# EAGLE design kline to db9 (EAGLE 4.13)
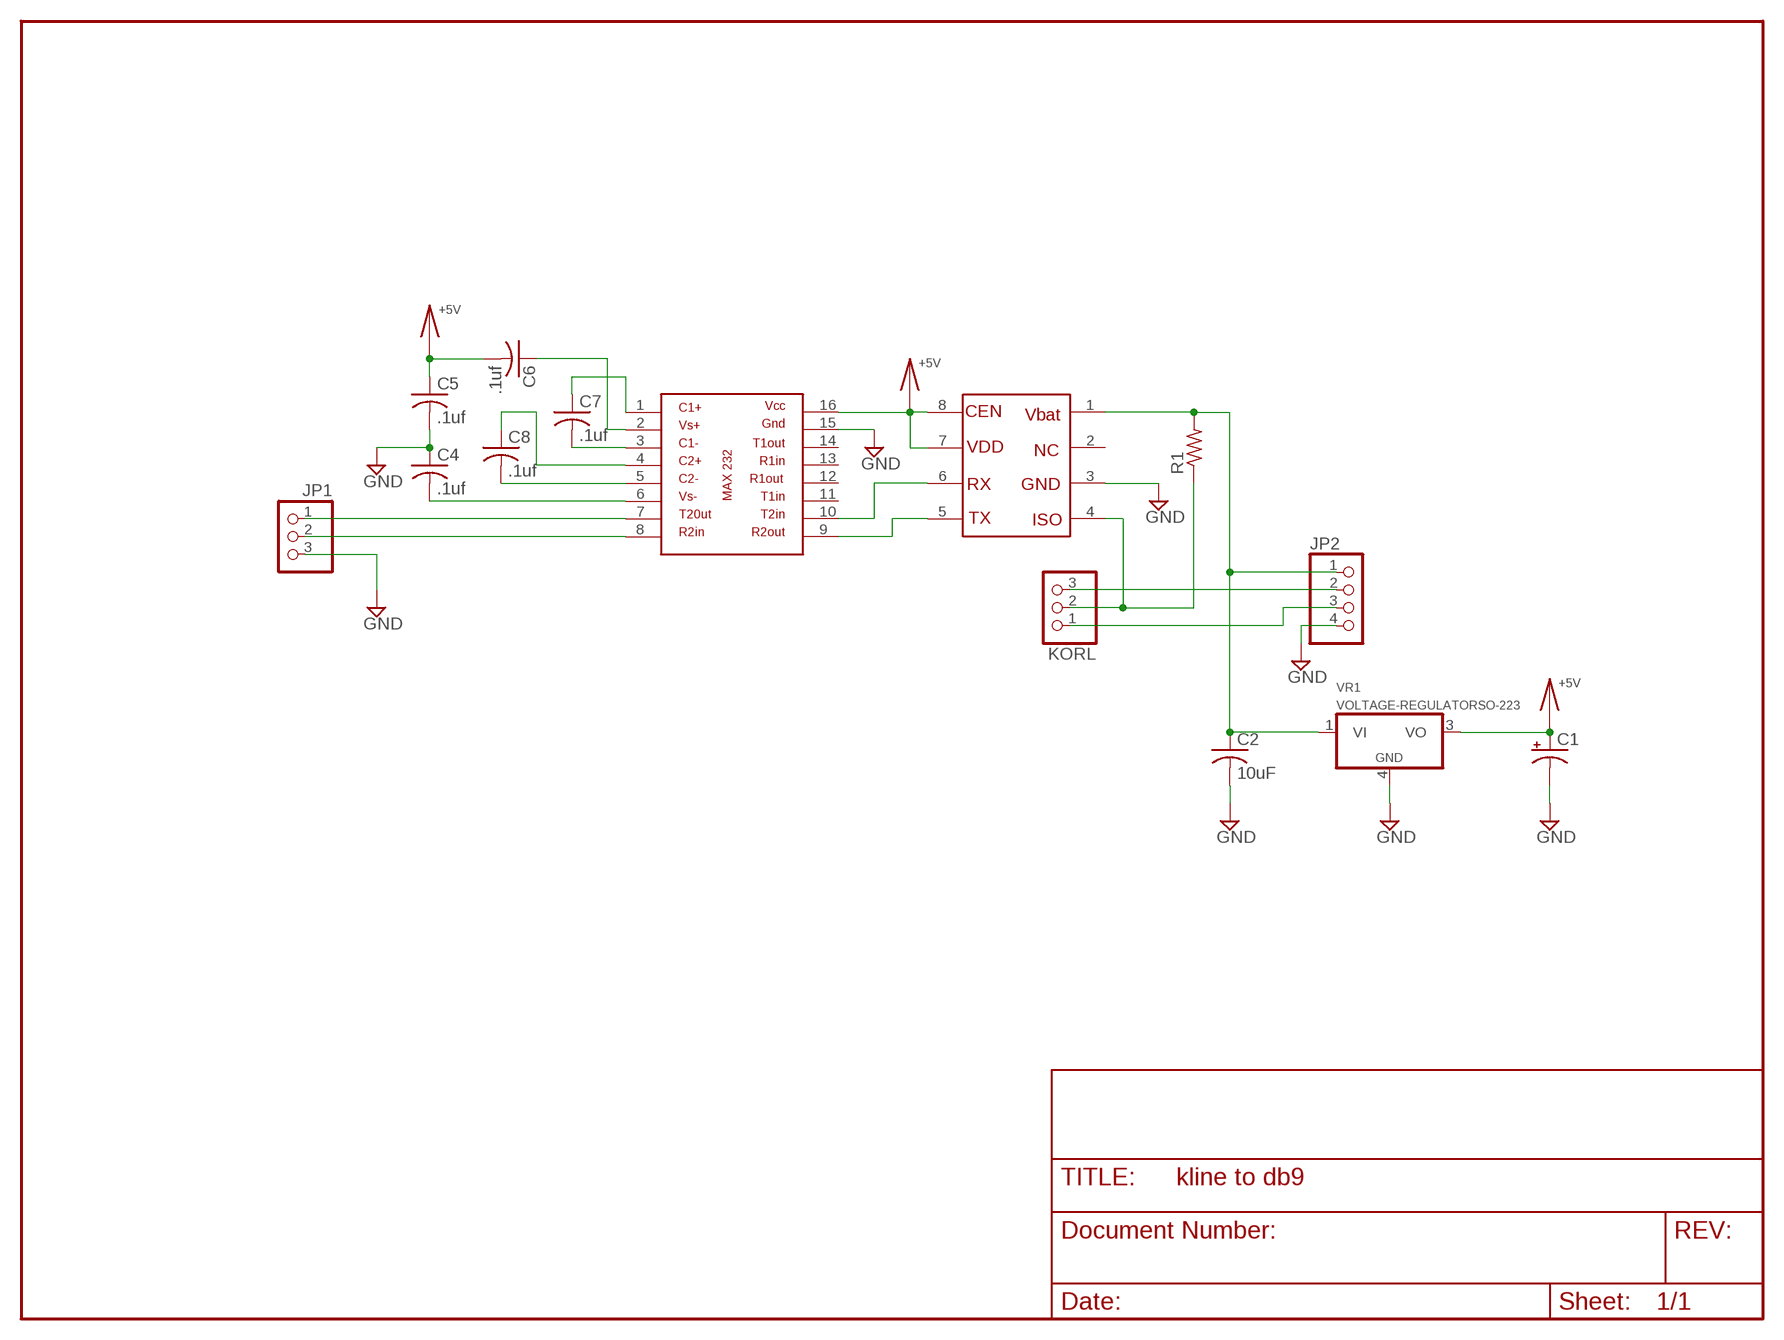
[diagram p0: schematic, sheet 1]

## Parts
C1  CAPACITOR-ELECTROLYTICD  [PANASONIC_D]
C2  10uF  CAPACITOR-NO-POLARITYC1210K  [C1210K]
C4  .1uf  CAPACITOR-NO-POLARITYC1210K  [C1210K]
C5  .1uf  CAPACITOR-NO-POLARITYC1210K  [C1210K]
C6  .1uf  CAPACITOR-NO-POLARITYC1210K  [C1210K]
C7  .1uf  CAPACITOR-NO-POLARITYC1210K  [C1210K]
C8  .1uf  CAPACITOR-NO-POLARITYC1210K  [C1210K]
JP1  PINHD-1X3  [1X03]
JP2  PINHD-1X4  [1X04]
KORL  PINHD-1X3  [1X03]
MCZ33290  MCZ33290  [SO08]
R1  RESISITOR0411/15  [0411/15]
U$1  MAX232  [SO16]
VR1  VOLTAGE-REGULATORSO-223  [SOT223R_INFINEON]

## Nets
+5V: C1.+ C5.1 C6.2 MCZ33290.7 MCZ33290.8 U$1.16 VR1.3(VO)
GND: C1.- C2.2 C4.1 C5.2 JP1.3 JP2.4 MCZ33290.3 U$1.15 VR1.4(GND)
N$1: JP2.2 KORL.3
N$2: C2.1 JP2.1 MCZ33290.1 R1.2 VR1.1(VI)
N$3: KORL.2 MCZ33290.4 R1.1
N$4: JP2.3 KORL.1
N$6: MCZ33290.6 U$1.10
N$7: MCZ33290.5 U$1.9
N$8: JP1.1 U$1.7
N$9: JP1.2 U$1.8
N$13: C6.1 U$1.2
N$14: C7.2 U$1.3
N$15: C7.1 U$1.1
N$16: C8.2 U$1.5
N$17: C4.2 U$1.6
N$18: C8.1 U$1.4
Unconnected: MCZ33290.2 U$1.11 U$1.12 U$1.13 U$1.14

## Library data of the parts
C1 = 1 Dan's Common Parts:CAPACITOR-ELECTROLYTIC: POLARIZED CAPACITOR, American symbol
C2 C4-C8 = 1 Dan's Common Parts:CAPACITOR-NO-POLARITY: CAPACITOR, American symbol
JP1 KORL = pinhead:PINHD-1X3: PIN HEADER
JP2 = pinhead:PINHD-1X4: PIN HEADER
MCZ33290 = 1 Dan's Common Parts:MCZ33290
R1 = 1 Dan's Common Parts:RESISITOR: RESISTOR, American symbol
U$1 = 1 Dan's Common Parts:MAX232
VR1 = 1 Dan's Common Parts:VOLTAGE-REGULATOR: Positive VOLTAGE REGULATOR Source: http://cache.national.com/ds/LM/LM78L05.pdf http://www.fairchildsemi.com/ds/LM/LM7805.pdf

## Board
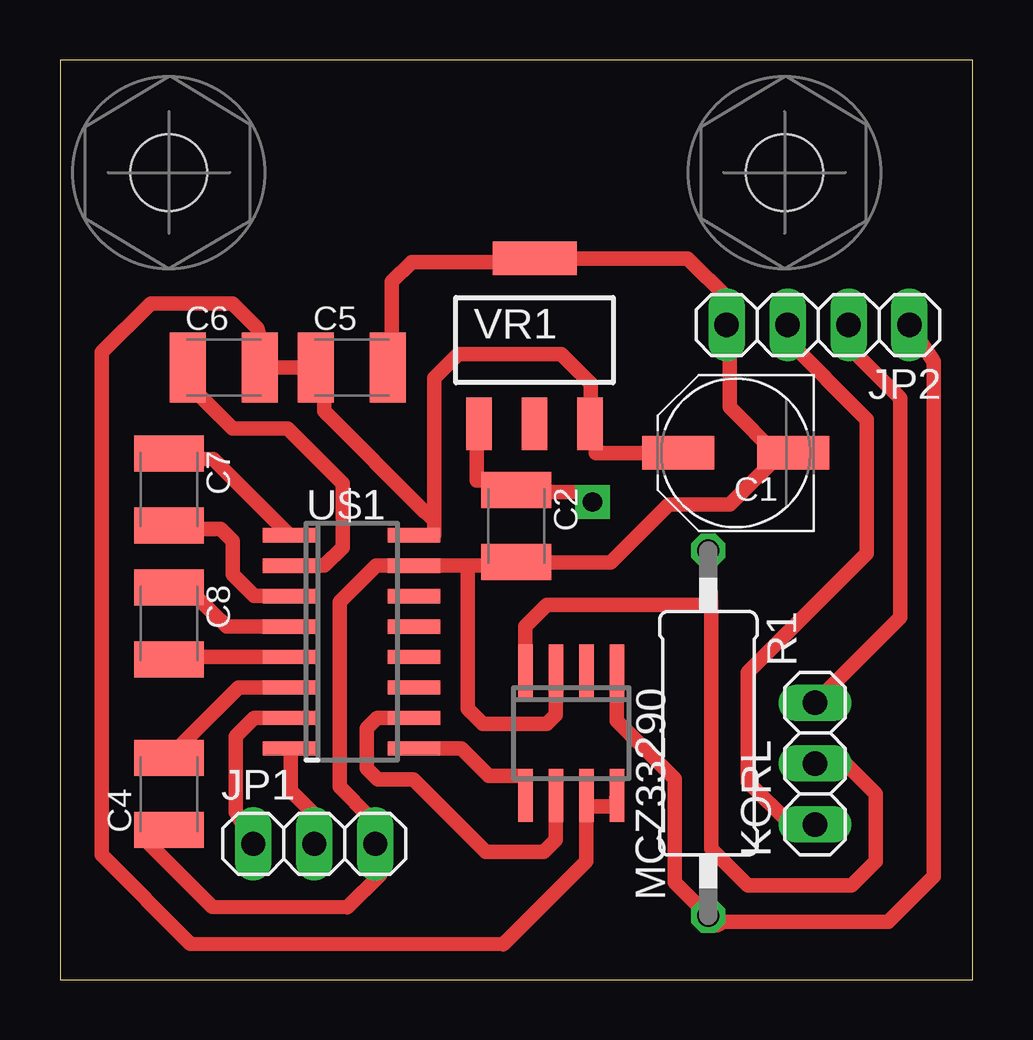
[diagram p1: board, top side]
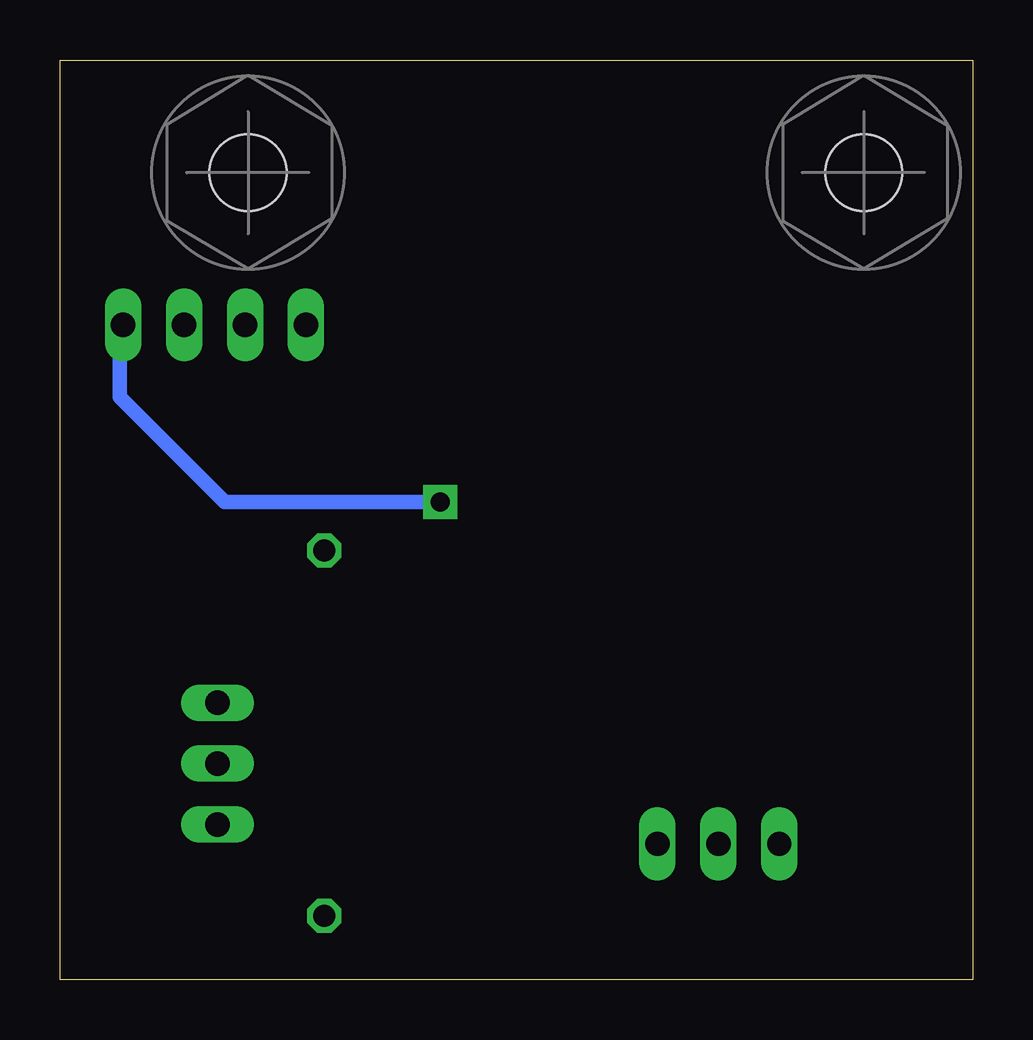
[diagram p2: board, bottom side, seen from below]

Size 38.02 x 38.34 mm. Coordinates in mm from the lower left corner, seen from the top.
Outline: 0,0 38.02,0 38.02,38.34 0,38.34 0,0
Copper layers (1*16): Top 0.035mm / dielectric 1.5mm / Bottom 0.035mm
Design rules "default": minimum track width 15mil, minimum drill 24mil, track to track 20mil, track to pad 20mil, pad to pad 20mil, via to via 20mil, smd to smd 20mil, copper to edge 40mil, drill to drill 8mil, minimum pad ring 10mil, minimum via ring 8mil, stop-mask expansion 4mil, vias tented up to drill 0mil, thermal gap 10mil

### Footprints (pad centres in the part's own frame; a part is rotated, then mirrored left to right if it is on the bottom)
PANASONIC_D = smd 3 x 1.4: + 2.4,0; - -2.4,0
C1210K = smd 1.5 x 2.9: 1 -1.5,0; 2 1.5,0
1X03 = drill 1.016 long: 1 -2.54,0; 2 0,0; 3 2.54,0
1X04 = drill 1.016 long: 1 -3.81,0; 2 -1.27,0; 3 1.27,0; 4 3.81,0
SO08 = smd 0.6 x 2.2: 1 -1.905,-2.6; 2 -0.635,-2.6; 3 0.635,-2.6; 4 1.905,-2.6; 5 1.905,2.6; 6 0.635,2.6; 7 -0.635,2.6; 8 -1.905,2.6
0411/15 = drill 0.914 octagon: 1 -7.62,0; 2 7.62,0
SO16 = smd 0.6 x 2.2: 1 -4.445,-2.6; 2 -3.175,-2.6; 3 -1.905,-2.6; 4 -0.635,-2.6; 5 0.635,-2.6; 6 1.905,-2.6; 7 3.175,-2.6; 8 4.445,-2.6; 9 4.445,2.6; 10 3.175,2.6; 11 1.905,2.6; 12 0.635,2.6; 13 -0.635,2.6; 14 -1.905,2.6; 15 -3.175,2.6; 16 -4.445,2.6
SCREW = hole 3.2: 0,0
SOT223R_INFINEON = smd 1.067 x 2.184: 1 -2.311,-3.479; 2 0,-3.48; 3 2.312,-3.48 | smd 3.5 x 1.4: 4 0,3.404

### Placement (x,y rotation side)
C1  28.16,21.97 180 top
C2  19.01,18.92 270 top
C4  4.53,7.74 90 top
C5  12.15,25.52 0 top
C6  6.82,25.52 0 top
C7  4.53,20.44 270 top
C8  4.53,14.85 270 top
JP1  10.59,5.67 0 top
JP2  31.59,27.3 180 top
KORL  31.46,9.01 90 top
MCZ33290  21.3,10.28 180 top
R1  27.01,10.28 270 top
U$1  12.15,14.09 270 top
U$3  [SCREW]  4.53,33.65 0 top
U$4  [SCREW]  30.19,33.65 0 top
VR1  19.77,26.66 0 top

### Tracks (layer width: path | path; a pad name or v marks a point on that pad's centre or on a via)
+5V
  Top 0.61: 8.72,25.52 C5.1 11.01,25.42 | 8.72,25.52 C6.2 | 11.01,25.42 11.01,25.52 8.72,25.52 | 11.01,25.42 11.01,23.7 15.2,19.51 15.24,19.51 15.58,19.17 | 8.72,25.52 8.6,25.65 8.22,27.17 7.2,28.19 3.77,28.19 1.74,26.16 1.74,5.2 5.43,1.49 18.47,1.49 21.93,4.95 MCZ33290.7 21.99,7.23 23.14,7.23 MCZ33290.8 | 15.58,19.17 15.58,25.08 16.59,26.08 20.88,26.08 22.11,24.85 22.11,23.36 | 22.11,23.36 22.09,23.13 VR1.3 | 22.11,23.36 22.25,23.22 22.25,22.67 22.31,22.6 22.31,21.97 C1.+ | 15.58,19.17 15.58,18.54 U$1.16
GND
  Top 0.406: 13.83,25.52 C5.2
  Top 0.61: 20.77,17.39 C2.2 18.76,17.65 18.63,17.65 18,17.27 16.98,17.27 | 4.53,6.47 C4.1 3.54,5.85 6.35,3.04 11.98,3.02 13.34,4.38 13.3,5.33 JP1.3 12.92,6.22 12.92,6.77 11.65,8.04 11.65,15.74 13.17,17.27 14.57,17.27 | MCZ33290.3 20.66,11.04 20.28,10.66 17.61,10.66 16.98,11.3 16.98,17.27 | 14.57,17.27 14.44,17.27 | 16.98,17.27 U$1.15 14.57,17.27 | 16.98,17.27 17.11,17.27 | 30.06,21.97 C1.- | 29.93,21.97 30.19,22.09 | 29.93,21.97 30.06,21.97 | 29.93,21.84 29.93,21.97 | 29.93,21.84 27.9,23.87 27.9,26.03 | 27.9,26.03 JP2.4 27.81,27.3 27.84,27.28 | 27.9,26.03 27.9,26.54 | 30.19,22.09 30.19,22.22 | 20.77,17.39 20.54,17.39 | 20.77,17.39 22.95,17.39 25.36,19.81 27.9,19.81 29.93,21.84 | 29.93,21.84 30.06,21.97 | 30.06,21.97 30.19,22.09 | 13.83,29.1 13.83,25.52 | 13.83,29.1 | 13.83,29.1 14.65,29.92 20.82,29.92 21.04,30.15 VR1.4 26.15,30.07 27.84,28.39 27.84,27.28 | 27.84,27.28 27.87,27.24
N$1
  Top 0.61: JP2.2 32.73,26.54 35.01,24.25 35.01,15.11 KORL.3
N$2  (via drill 0.8 pad 1.42)
  Top 0.61: C2.1 18.66,20.82 17.36,20.82 17.36,23.21 VR1.1 | JP2.1 36.41,25.78 36.41,4.31 34.51,2.41 27.65,2.41 | 19.01,20.7 C2.1 | C2.1 19.24,20.7 19.01,20.7 | 27.65,2.41 R1.2 | 27.65,2.41 27.39,2.28 25.62,4.06 25.62,8.38 23.2,10.79 MCZ33290.1 | 19.01,20.7 19.66,20.7 20.02,20.34 21.76,20.34 v22.19,19.91
  Bottom 0.61: v22.19,19.91 31.16,19.91 35.53,24.29 35.53,27.2 35.4,27.33 | 35.4,27.33 35.34,27.39 | JP2.1 35.4,27.33
N$3
  Top 0.61: 27.14,15.62 27.14,5.46 28.66,3.93 32.98,3.93 34,4.95 34,7.74 32.47,9.27 32.22,9.27 KORL.2 | 27.14,15.62 R1.1 | MCZ33290.4 19.39,14.73 20.28,15.62 27.14,15.62
N$4
  Top 0.61: KORL.1 30.44,6.47 28.66,8.25 28.66,12.82 33.62,17.77 33.62,23.36 30.19,26.79 JP2.3
N$6
  Top 0.61: MCZ33290.6 20.66,5.84 20.16,5.33 17.74,5.33 14.72,8.35 13.25,8.35 12.79,8.81 12.79,10.48 13.22,10.92 U$1.10 14.87,10.92
N$7
  Top 0.61: U$1.9 16.73,9.65 17.87,8.5 19.39,8.5 MCZ33290.5 19.39,8.38
N$8
  Top 0.61: U$1.7 8.09,10.92 7.33,10.15 7.33,6.98 JP1.1
N$9
  Top 0.61: 9.61,9.45 9.61,7.87 10.63,6.85 JP1.2 | 9.61,9.45 9.61,9.52 | 9.61,9.45 U$1.8
N$13
  Top 0.61: U$1.2 11.01,17.27 11.77,18.03 11.77,20.7 9.49,22.98 7.2,22.98 5.68,24.51 5.68,25.9 C6.1
N$14
  Top 0.61: U$1.3 8.09,16 7.2,16.89 7.2,18.28 6.69,18.79 4.66,18.79 4.66,18.82 C7.2
N$15
  Top 0.61: C7.1 4.53,21.71 6.38,21.71 U$1.1
N$16
  Top 0.61: 9.87,13.46 U$1.5 5.4,13.46 C8.2
N$17
  Top 0.61: U$1.6 7.46,12.19 4.79,9.52 4.41,9.39 4.41,9.37 C4.2
N$18
  Top 0.61: C8.1 5.53,16.12 6.31,15.36 6.95,14.73 U$1.4 9.61,14.73